# EAGLE design ACESDolginIntersectionV2 (EAGLE 9.4.2)
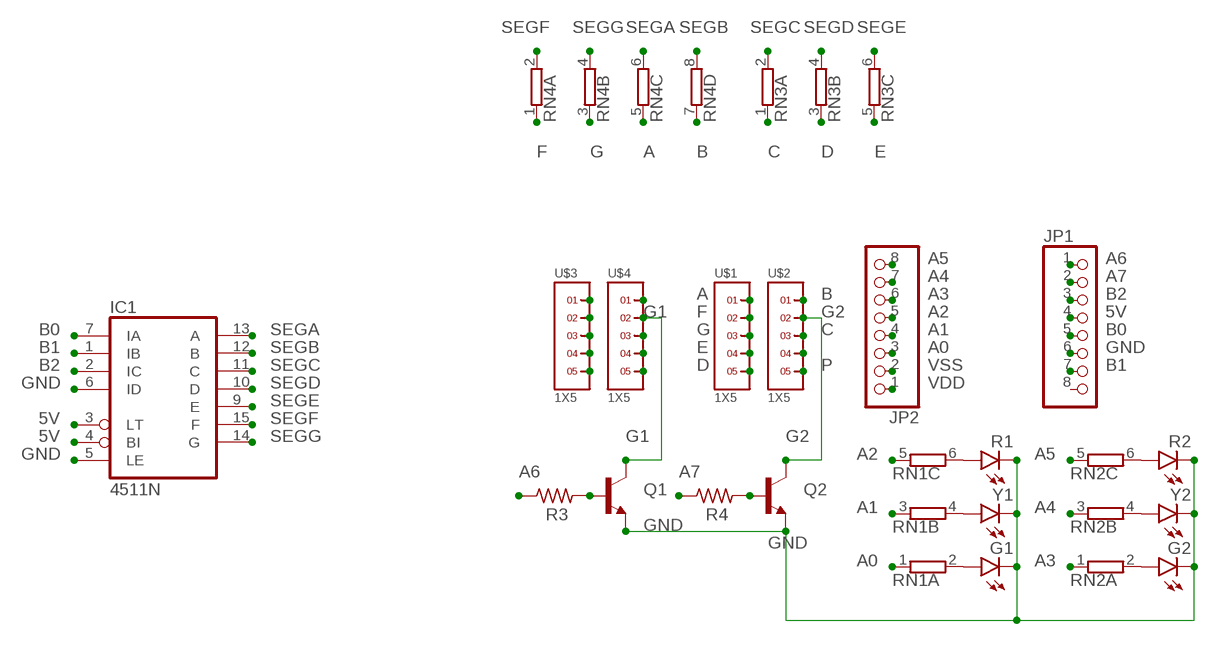
[diagram p0: schematic, sheet 1]

## Parts
G1  LED3MM  [LED3MM]
G2  LED3MM  [LED3MM]
IC1  4511N  [DIL16]
JP1  PINHD-1X8  [1X08]
JP2  PINHD-1X8  [1X08]
Q1  NPN2N3904  [2N3904]
Q2  NPN2N3904  [2N3904]
R1  LED3MM  [LED3MM]
R2  LED3MM  [LED3MM]
R3  R-US_0207/10  [0207/10]
R4  R-US_0207/10  [0207/10]
RN1  E3R  [SIL6]
RN2  E3R  [SIL6]
RN3  E3R  [SIL6]
RN4  E4R  [SIL8]
U$1  1X5  [1X5]
U$2  1X5  [1X5]
U$3  1X5  [1X5]
U$4  1X5  [1X5]
Y1  LED3MM  [LED3MM]
Y2  LED3MM  [LED3MM]

## Nets
5V: IC1.3(LT) IC1.4(BI) JP1.4
A: RN4.5 U$1.1 U$3.1
A0: JP2.3 RN1.1
A1: JP2.4 RN1.3
A2: JP2.5 RN1.5
A3: JP2.6 RN2.1
A4: JP2.7 RN2.3
A5: JP2.8 RN2.5
A6: JP1.1 R3.1
A7: JP1.2 R4.1
B: RN4.7 U$2.1 U$4.1
B0: IC1.7(IA) JP1.5
B1: IC1.1(IB) JP1.7
B2: IC1.2(IC) JP1.3
C: RN3.1 U$2.3 U$4.3
D: RN3.3 U$1.5 U$3.5
E: RN3.5 U$1.4 U$3.4
F: RN4.1 U$1.2 U$3.2
G: RN4.3 U$1.3 U$3.3
G1: Q1.C U$4.2
G2: Q2.C U$2.2
GND: G1.K(C) G2.K(C) IC1.5(LE) IC1.6(ID) JP1.6 Q1.E Q2.E R1.K(C) R2.K(C) U$2.4 U$4.4 Y1.K(C) Y2.K(C)
N$1: G1.A RN1.2
N$9: RN1.4 Y1.A
N$10: R1.A RN1.6
N$20: G2.A RN2.2
N$21: RN2.4 Y2.A
N$24: R2.A RN2.6
P: U$2.5 U$4.5
Q1BASE: Q1.B R3.2
Q2BASE: Q2.B R4.2
SEGA: IC1.13(A) RN4.6
SEGB: IC1.12(B) RN4.8
SEGC: IC1.11(C) RN3.2
SEGD: IC1.10(D) RN3.4
SEGE: IC1.9(E) RN3.6
SEGF: IC1.15(F) RN4.2
SEGG: IC1.14(G) RN4.4
VDD: JP2.1
VSS: JP2.2
Unconnected: JP1.8

## Power pins joined to a net without a drawn wire
VDD: IC1.16(VDD)
VSS: IC1.8(VSS)

## Library data of the parts
G1 G2 R1 R2 Y1 Y2 = led:LED: LED OSRAM: - CHIPLED LG R971, LG N971, LY N971, LG Q971, LY Q971, LO R971, LY R971 LH N974, LH R974 LS Q976, LO Q976, LY Q976 LO Q996 - Hyper CHIPLED LW Q18S LB Q993, LB Q99A, LB R99A - SideLED LS A670, LO A670, LY A670, LG A670, LP A670 LB A673, LV A673, LT A673, LW A673 LH A674 LY A675 LS A676, LA A676, LO A676, LY A676, LW A676 LS A679, LY A679, LG A679 - Hyper Micro SIDELED® LS Y876, LA Y876, LO Y876, LY Y876 LT Y87S - SmartLED LW L88C, LW L88S LB L89C, LB L89S, LG L890 LS L89K, LO L89K, LY L89K LS L896, LA L896, LO L896, LY L896 - TOPLED LS T670, LO T670, LY T670, LG T670, LP T670 LSG T670, LSP T670, LSY T670, LOP T670, LYG T670 LG T671, LOG T671, LSG T671 LB T673, LV T673, LT T673, LW T673 LH T674 LS T676, LA T676, LO T676, LY T676, LB T676, LH T676, LSB T676, LW T676 LB T67C, LV T67C, LT T67C, LS T67K, LO T67K, LY T67K, LW E67C LS E67B, LA E67B, LO E67B, LY E67B, LB E67C, LV E67C, LT E67C LW T67C LS T679, LY T679, LG T679 LS T770, LO T770, LY T770, LG T770, LP T770 LB T773, LV T773, LT T773, LW T773 LH T774 LS E675, LA E675, LY E675, LS T675 LS T776, LA T776, LO T776, LY T776, LB T776 LHGB T686 LT T68C, LB T68C - Hyper Mini TOPLED® LB M676 - Mini TOPLED Santana® LG M470 LS M47K, LO M47K, LY M47K Source: http://www.osram.convergy.de LUXEON: - LUMILED® LXK2-PW12-R00, LXK2-PW12-S00, LXK2-PW14-U00, LXK2-PW14-V00 LXK2-PM12-R00, LXK2-PM12-S00, LXK2-PM14-U00 LXK2-PE12-Q00, LXK2-PE12-R00, LXK2-PE12-S00, LXK2-PE14-T00, LXK2-PE14-U00 LXK2-PB12-K00, LXK2-PB12-L00, LXK2-PB12-M00, LXK2-PB14-N00, LXK2-PB14-P00, LXK2-PB14-Q00 LXK2-PR12-L00, LXK2-PR12-M00, LXK2-PR14-Q00, LXK2-PR14-R00 LXK2-PD12-Q00, LXK2-PD12-R00, LXK2-PD12-S00 LXK2-PH12-R00, LXK2-PH12-S00 LXK2-PL12-P00, LXK2-PL12-Q00, LXK2-PL12-R00 Source: www.luxeon.com KINGBRIGHT: KA-3528ASYC Source: www.kingbright.com
IC1 = 45xx:4511: BCD to 7-segment LATCH/DECODER/DRIVER
JP1 JP2 = pinhead:PINHD-1X8: PIN HEADER
Q1 Q2 = ACES_THT:NPN: NPN TRANSISTOR Big oval pads
R3 R4 = rcl:R-US_: RESISTOR, American symbol; SPICEPREFIX: R
RN1-RN3 = resistor-sil:E3R: SIL RESISTOR; OC_FARNELL: unknown; OC_NEWARK: unknown
RN4 = resistor-sil:E4R: SIL RESISTOR; OC_FARNELL: unknown; OC_NEWARK: unknown
U$1-U$4 = headers(2mm):1X5

## Board
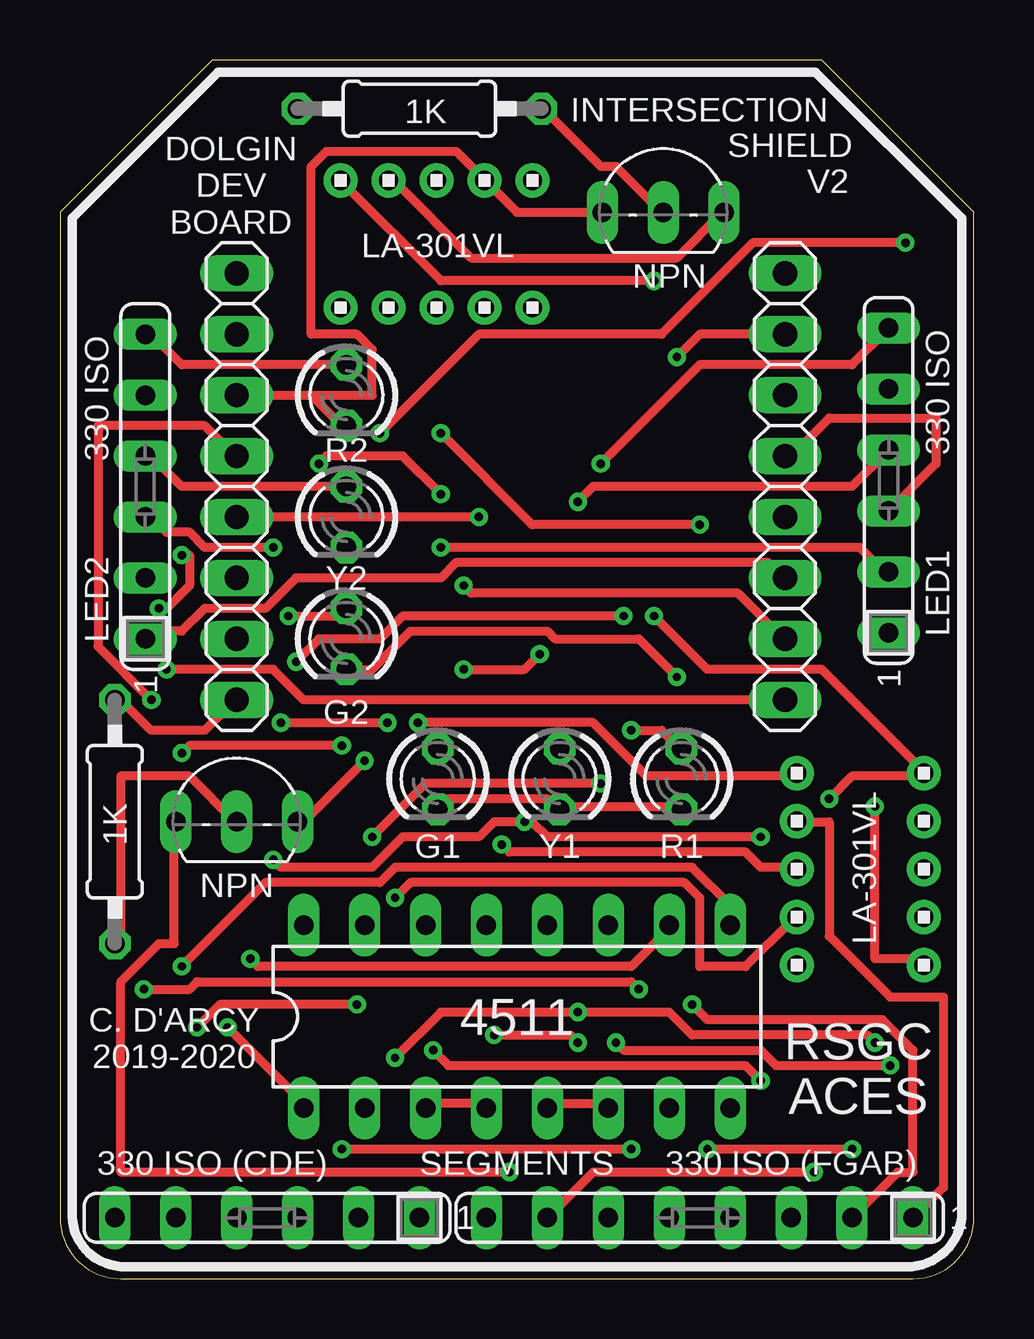
[diagram p1: board, top side]
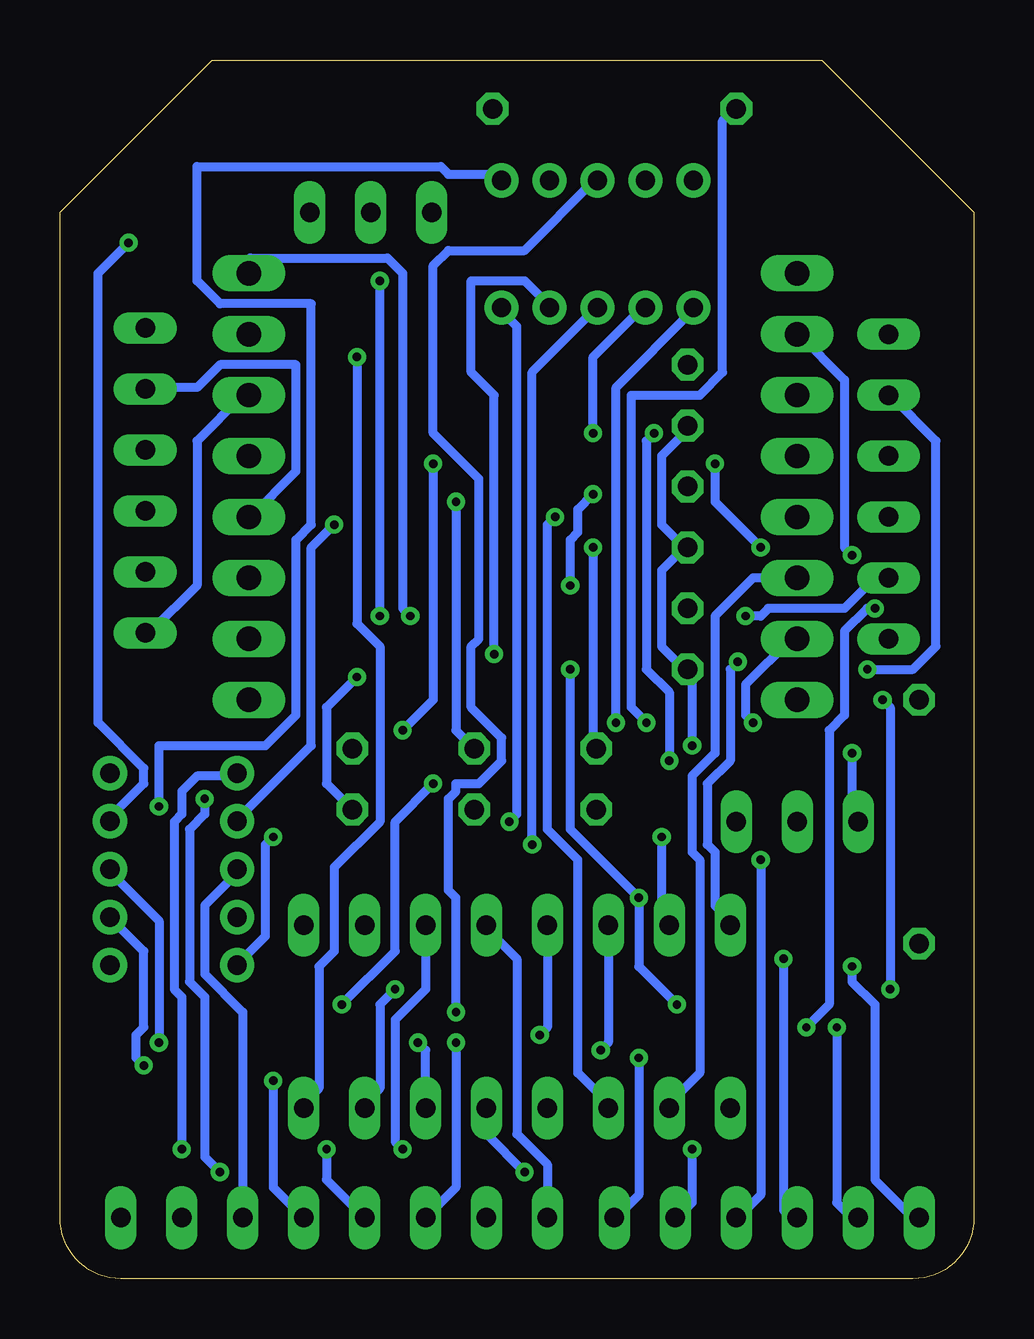
[diagram p2: board, bottom side, seen from below]

Size 38.1 x 50.8 mm. Coordinates in mm from the lower left corner, seen from the top.
Outline: 0,44.45 0,2.54 arc90 2.54,0 35.56,0 arc90 38.1,2.54 38.1,44.45 31.75,50.8 6.35,50.8 0,44.45
Copper layers (1*16): Top 0.035mm / dielectric 1.5mm / Bottom 0.035mm
Design rules "default *": minimum track width 15mil, minimum drill 0.35mm, track to track 8mil, track to pad 8mil, pad to pad 8mil, via to via 8mil, smd to smd 6mil, copper to edge 40mil, drill to drill 6mil, minimum pad ring 10mil, minimum via ring 8mil, stop-mask expansion 4mil, vias tented up to drill 0mil, thermal gap 10mil

### Footprints (pad centres in the part's own frame; a part is rotated, then mirrored left to right if it is on the bottom)
LED3MM = drill 0.813 octagon: A -1.27,0; K 1.27,0
DIL16 = drill 0.813 long: 1 -8.89,-3.81; 2 -6.35,-3.81; 3 -3.81,-3.81; 4 -1.27,-3.81; 5 1.27,-3.81; 6 3.81,-3.81; 7 6.35,-3.81; 8 8.89,-3.81; 9 8.89,3.81; 10 6.35,3.81; 11 3.81,3.81; 12 1.27,3.81; 13 -1.27,3.81; 14 -3.81,3.81; 15 -6.35,3.81; 16 -8.89,3.81
1X08 = drill 1.016 long: 1 -8.89,0; 2 -6.35,0; 3 -3.81,0; 4 -1.27,0; 5 1.27,0; 6 3.81,0; 7 6.35,0; 8 8.89,0
2N3904 = drill 0.813 long: B 0,-1.27; C 2.54,-1.27; E -2.54,-1.27
0207/10 = drill 0.813 octagon: 1 -5.08,0; 2 5.08,0
SIL6 = drill 0.813 long: 1 -6.35,0; 2 -3.81,0; 3 -1.27,0; 4 1.27,0; 5 3.81,0; 6 6.35,0
SIL8 = drill 0.813 long: 1 -8.89,0; 2 -6.35,0; 3 -3.81,0; 4 -1.27,0; 5 1.27,0; 6 3.81,0; 7 6.35,0; 8 8.89,0
1X5 = drill 0.8 pad 1.422: 1 -4,0; 2 -2,0; 3 0,0; 4 2,0; 5 4,0

### Placement (x,y rotation side)
G1  15.75,20.83 270 top
G2  11.94,26.67 270 top
IC1  19.05,10.92 0 top
JP1  7.37,33.02 90 top
JP2  30.23,33.02 270 top
Q1  7.37,20.32 0 top
Q2  25.15,45.72 0 top
R1  25.91,20.83 270 top
R2  11.94,36.83 270 top
R3  2.29,19.05 270 top
R4  14.99,48.77 0 top
RN1  34.54,33.27 90 top
RN2  3.56,33.02 90 top
RN3  8.64,2.54 180 top
RN4  26.67,2.54 180 top
U$1  15.7,40.48 0 top
U$2  15.7,45.78 0 top
U$3  30.72,17.07 270 top
U$4  36.02,17.07 270 top
U$5  [ACES_LOGO_MEDIUM]  21.34,31.5 0 top
Y1  20.83,20.83 270 top
Y2  11.94,31.75 270 top

### Tracks (layer width: path | path; a pad name or v marks a point on that pad's centre or on a via)
5V  (via drill 0.35)
  Top 0.381: IC1.3 15.24,7.3 17.78,7.3 IC1.4 | v17.46,31.75 JP1.4
  Bottom 0.381: v17.46,31.75 17.78,31.43 17.78,18.73 16.51,17.46 16.51,8.57 15.24,7.3 IC1.3
A  (via drill 0.35)
  Top 0.381: v33.02,5.4 v26.99,5.4 | v14.92,23.18 22.23,23.18 24.45,20.95 30.48,20.95 U$3.1
  Bottom 0.381: RN4.5 26.99,4.13 v26.99,5.4 | v33.02,5.4 33.02,11.75 33.34,12.06 33.34,19.05 33.02,19.37 33.02,20.32 32.38,20.95 30.8,20.95 U$3.1 | v14.92,23.18 14.92,37.15 11.75,40.32 U$1.1
A0
  Bottom 0.381: RN1.1 34.29,26.99 32.38,28.89 32.38,34.92 30.48,36.83 JP2.3
A1
  Top 0.381: RN1.3 36.51,33.97 36.51,35.88 32.07,35.88 30.48,34.29 JP2.4
A2
  Bottom 0.381: RN1.5 34.29,37.15 32.38,37.15 31.43,38.1 28.26,38.1 28.26,33.66 30.16,31.75 JP2.5
A3
  Top 0.381: RN2.1 3.81,26.67 4.13,26.99 5.08,26.99 6.03,27.94 8.57,27.94 9.84,29.21 15.88,29.21 16.51,29.84 29.53,29.84 30.16,29.21 JP2.6
A4  (via drill 0.35)
  Top 0.381: v8.89,30.48 6.03,30.48 5.4,31.11 4.45,31.11 3.81,31.75 RN2.3 | v10.79,33.97 11.11,34.29 14.29,34.29 v15.88,32.7 | v16.83,28.89 17.14,28.57 28.26,28.57 30.16,26.67 JP2.7
  Bottom 0.381: v8.89,30.48 10.79,32.38 v10.79,33.97 | v15.88,32.7 16.51,32.07 16.51,31.11 16.83,30.8 v16.83,28.89
A5  (via drill 0.35)
  Top 0.381: v4.45,25.4 8.89,25.4 10.16,24.13 JP2.8
  Bottom 0.381: v4.45,25.4 2.54,25.4 1.59,26.35 1.59,34.92 3.49,36.83 RN2.5
A6
  Top 0.381: R3.1 2.54,24.13 3.81,22.86 6.03,22.86 7.3,24.13 JP1.1
A7  (via drill 0.35)
  Top 0.381: v9.21,23.18 v13.65,23.18
  Bottom 0.381: v13.65,23.18 14.29,23.81 14.29,36.83 11.43,36.83 10.48,37.78 10.48,48.26 10.16,48.58 R4.1 | v9.21,23.18 9.53,23.5 9.53,24.77 7.62,26.67 JP1.2
B  (via drill 0.35)
  Top 0.381: RN4.7 22.23,4.45 v31.43,4.45 | v32.07,20 33.02,20.95 35.88,20.95 U$4.1 35.88,21.27 31.75,25.4 26.99,25.4 v24.77,27.62 | v24.77,41.59 15.88,41.59 11.75,45.72 U$2.1
  Bottom 0.381: v31.43,4.45 32.07,5.08 32.07,11.75 32.7,12.38 32.7,18.73 32.07,19.37 v32.07,20 | v24.77,27.62 v24.77,41.59
B0  (via drill 0.35)
  Top 0.381: v24.13,12.06 23.81,12.38 5.71,12.38 5.4,12.06 v3.49,12.06 | v3.81,24.13 1.59,26.35 1.59,35.56 6.03,35.56 7.3,34.29 JP1.5
  Bottom 0.381: v24.13,12.06 24.77,11.43 24.77,7.94 25.4,7.3 IC1.7 | v3.49,12.06 3.49,23.81 v3.81,24.13
B1  (via drill 0.35)
  Top 0.381: v6.99,10.48 10.16,7.3 IC1.1 | v4.13,27.94 4.45,27.94 5.4,28.89 5.4,30.16 v5.08,30.16
  Bottom 0.381: v6.99,10.48 6.03,11.43 6.03,22.86 5.4,23.5 5.4,26.99 4.45,27.94 v4.13,27.94 | v5.08,30.16 5.4,30.48 5.4,37.47 7.3,39.37 JP1.7
B2
  Bottom 0.381: JP1.3 9.21,29.21 10.79,27.62 10.79,21.91 11.75,20.95 11.75,17.78 11.43,17.46 11.43,8.57 12.7,7.3 IC1.2
C  (via drill 0.35)
  Top 0.381: v13.97,9.21 15.88,11.11 v21.59,11.11 25.4,11.11 26.35,10.16 33.66,10.16 v33.97,9.84
  Bottom 0.381: v13.97,9.21 13.97,3.49 14.92,2.54 RN3.1 | v33.97,9.84 33.97,14.92 35.88,16.83 U$4.3 | v21.59,11.11 21.59,15.88 21.91,16.19 21.91,20 21.59,20.32 21.59,20.64 20.64,20.64 19.68,21.59 19.68,22.54 20.95,23.81 20.95,26.35 20.64,26.67 20.64,33.34 22.54,35.24 22.54,42.23 21.91,42.86 18.73,42.86 15.88,45.72 U$2.3
D  (via drill 0.35)
  Top 0.381: v8.89,17.46 9.21,17.14 13.02,17.14 14.29,18.41 17.46,18.41 18.1,19.05 v19.37,19.05 19.68,19.05 20.32,18.41 v29.21,18.41
  Bottom 0.381: v8.89,17.46 8.89,3.49 9.84,2.54 RN3.3 | v29.21,18.41 29.53,18.1 29.53,14.29 30.48,13.34 U$3.5 | v19.37,19.05 19.05,19.37 19.05,39.69 19.68,40.32 U$1.5
E  (via drill 0.35)
  Top 0.381: v5.71,10.48 6.67,11.43 v12.38,11.43 | v13.97,15.88 14.61,16.51 26.04,16.51 26.67,15.88 26.67,13.02 28.57,13.02 30.48,14.92 U$3.4 | v20,26.04 19.37,25.4 v16.83,25.4
  Bottom 0.381: v5.71,10.48 5.71,3.17 5.08,2.54 RN3.5 | v12.38,11.43 13.97,13.02 v13.97,15.88 16.83,18.73 v16.83,25.4 | v20,26.04 20,36.83 20.95,37.78 20.95,41.59 18.73,41.59 17.78,40.64 U$1.4
F  (via drill 0.35)
  Top 0.381: RN4.1 36.83,3.81 36.83,11.75 34.61,11.75 32.07,14.29 32.07,19.05 30.8,19.05 U$3.2 | v15.88,35.24 19.68,31.43 v26.67,31.43
  Bottom 0.381: v15.88,35.24 15.88,38.42 13.97,40.32 U$1.2 | v26.67,31.43 27.62,30.48 27.62,22.23 30.48,19.37 U$3.2
G  (via drill 0.35)
  Top 0.381: v18.41,18.1 18.73,17.78 28.57,17.78 29.21,17.14 30.48,17.14 U$3.3
  Bottom 0.381: RN4.3 30.48,11.11 32.07,12.7 32.07,15.56 30.8,16.83 U$3.3 | v18.41,18.1 18.41,37.78 15.88,40.32 U$1.3
G1  (via drill 0.35)
  Top 0.381: v12.7,21.59 10.16,19.05 Q1.C | v13.34,35.24 17.46,39.37 25.08,39.37 28.89,43.18 v35.24,43.18
  Bottom 0.381: v12.7,21.59 12.7,24.45 13.65,25.4 13.65,34.92 v13.34,35.24 | v35.24,43.18 36.51,41.91 36.51,23.18 34.61,21.27 34.61,20.64 35.88,19.37 U$4.2
G2
  Top 0.381: Q2.C 27.62,44.45 25.72,42.55 17.14,42.55 13.97,45.72 U$2.2
GND  (via drill 0.35)
  Top 0.381: v18.73,4.45 2.54,4.45 2.54,12.38 4.13,13.97 4.76,13.97 4.76,19.05 Q1.E | IC1.6 22.86,7.3 20.32,7.3 IC1.5 | v34.61,8.89 29.84,8.89 29.21,9.53 23.5,9.53 v23.18,9.84 | G1.K 16.19,20 20.32,20 20.64,19.68 Y1.K 20.95,19.68 25.72,19.68 R1.K | Q2.E 19.05,44.45 17.78,45.72 U$2.4 17.46,46.04 16.51,46.99 11.11,46.99 10.48,46.35 10.48,39.37 12.38,39.37 13.02,38.73 13.02,36.83 10.48,36.83 | 10.48,36.83 11.75,35.56 R2.K | JP1.6 10.48,36.83 | v25.72,25.08 24.13,26.67 20.64,26.67 20.32,26.99 14.61,26.99 13.02,25.4 G2.K | v5.08,21.91 5.4,22.23 v11.75,22.23
  Bottom 0.381: v18.73,4.45 20.32,6.03 IC1.5 | v34.61,8.89 34.92,9.21 34.92,10.16 34.61,10.48 34.61,13.65 35.88,14.92 U$4.4 | v23.18,9.84 22.86,9.53 IC1.6 | 12.06,30.48 13.02,29.53 13.02,26.35 12.06,25.4 G2.K 11.75,25.4 v11.75,22.23 | 12.06,30.48 13.02,31.43 13.02,34.29 12.06,35.24 12.06,35.56 R2.K | 12.06,30.48 Y2.K | R1.K 26.99,20.64 26.99,23.81 v25.72,25.08 | v5.08,21.91 5.08,19.05 Q1.E
N$1  (via drill 0.35)
  Top 0.381: v15.88,30.48 33.34,30.48 34.29,29.53 RN1.2
  Bottom 0.381: v15.88,30.48 15.88,22.23 G1.A
N$9  (via drill 0.35)
  Top 0.381: v21.59,32.38 22.23,33.02 33.02,33.02 RN1.4
  Bottom 0.381: Y1.A 21.59,22.86 v21.59,32.38
N$10  (via drill 0.35)
  Top 0.381: v23.81,22.86 25.08,22.86 25.72,22.23 R1.A | v22.54,33.97 26.67,38.1 33.02,38.1 RN1.6
  Bottom 0.381: v23.81,22.86 22.54,24.13 v22.54,33.97
N$20  (via drill 0.35)
  Top 0.381: v9.53,27.62 11.43,27.62 11.75,27.94 G2.A
  Bottom 0.381: v9.53,27.62 8.89,27.62 8.57,27.94 5.4,27.94 4.13,29.21 RN2.2
N$21
  Top 0.381: Y2.A 5.08,33.02 3.81,34.29 RN2.4
N$24
  Top 0.381: R2.A 5.08,38.1 3.81,39.37 RN2.6
P  (via drill 0.35)
  Top 0.381: v33.97,19.68 33.97,13.34 35.88,13.34 U$4.5
  Bottom 0.381: v33.97,19.68 33.97,22.23 29.53,22.23 28.26,23.5 28.26,30.8 27.62,31.43 27.62,40.64 31.43,40.64 32.38,41.59 32.38,46.35 22.23,46.35 21.91,46.04 20,46.04 U$2.5
Q1BASE
  Top 0.381: R3.2 2.54,13.97 2.54,20.95 5.4,20.95 7.3,19.05 Q1.B
Q2BASE
  Top 0.381: R4.2 20.32,48.58 22.54,46.35 23.18,46.35 25.08,44.45 Q2.B
SEGA  (via drill 0.35)
  Top 0.381: v21.59,9.84 21.27,10.16 v18.1,10.16
  Bottom 0.381: RN4.6 21.59,3.81 v21.59,9.84 | v18.1,10.16 17.78,10.48 IC1.13
SEGB
  Bottom 0.381: RN4.8 17.78,4.76 19.05,6.03 19.05,13.34 20.32,14.61 IC1.12
SEGC  (via drill 0.35)
  Top 0.381: v23.81,5.4 v11.75,5.4
  Bottom 0.381: v11.75,5.4 11.75,3.17 12.38,2.54 RN3.2 | v23.81,5.4 24.13,5.71 24.13,10.79 22.86,12.06 IC1.11
SEGD  (via drill 0.35)
  Top 0.381: v7.94,13.34 8.26,13.02 23.81,13.02 25.4,14.61 IC1.10
  Bottom 0.381: v7.94,13.34 7.94,2.86 7.62,2.54 RN3.4
SEGE  (via drill 0.35)
  Top 0.381: v5.08,13.02 8.57,16.51 13.34,16.51 13.97,17.14 26.35,17.14 27.94,15.56 IC1.9
  Bottom 0.381: v5.08,13.02 5.08,12.38 4.13,11.43 4.13,4.13 2.54,2.54 RN3.6
SEGF  (via drill 0.35)
  Top 0.381: v13.02,18.41 15.24,20.64 v22.54,20.64 | v26.35,11.43 26.99,10.79 34.29,10.79 35.56,9.53 35.56,4.45 34.92,4.45 RN4.2
  Bottom 0.381: v13.02,18.41 13.02,15.24 12.7,14.92 IC1.15 | v22.54,20.64 24.13,19.05 24.13,13.65 v26.35,11.43
SEGG  (via drill 0.35)
  Top 0.381: v29.21,8.26 28.57,8.89 16.19,8.89 v15.56,9.53
  Bottom 0.381: RN4.4 29.21,3.81 v29.21,8.26 | v15.56,9.53 15.24,9.84 IC1.14
VDD  (via drill 0.35)
  Top 0.381: v9.84,25.72 10.79,26.67 13.34,26.67 14.29,27.62 v23.5,27.62
  Bottom 0.381: v9.84,25.72 10.16,25.4 10.16,21.59 11.11,20.64 11.11,18.1 10.79,17.78 10.79,15.56 10.16,14.92 IC1.16 | v23.5,27.62 23.81,27.94 23.81,41.91 24.45,42.55 30.16,42.55 30.16,41.91 JP2.1
VSS  (via drill 0.35)
  Top 0.381: v25.72,38.42 26.67,39.37 JP2.2
  Bottom 0.381: v25.72,38.42 25.72,27.3 24.77,26.35 24.77,19.05 26.67,17.14 26.67,13.65 27.3,13.02 27.3,7.94 27.94,7.3 IC1.8

### Text on the board
_tsilk: 1K | INTERSECTION / SHIELD / V2 | DOLGIN / DEV / BOARD | LA-301VL | NPN | LED2 330 ISO | LED1 330 ISO | 1K | LA-301VL | NPN | C. D'ARCY / 2019-2020 | 4511 | RSGC / ACES | 330 ISO (CDE) | SEGMENTS | 330 ISO (FGAB)